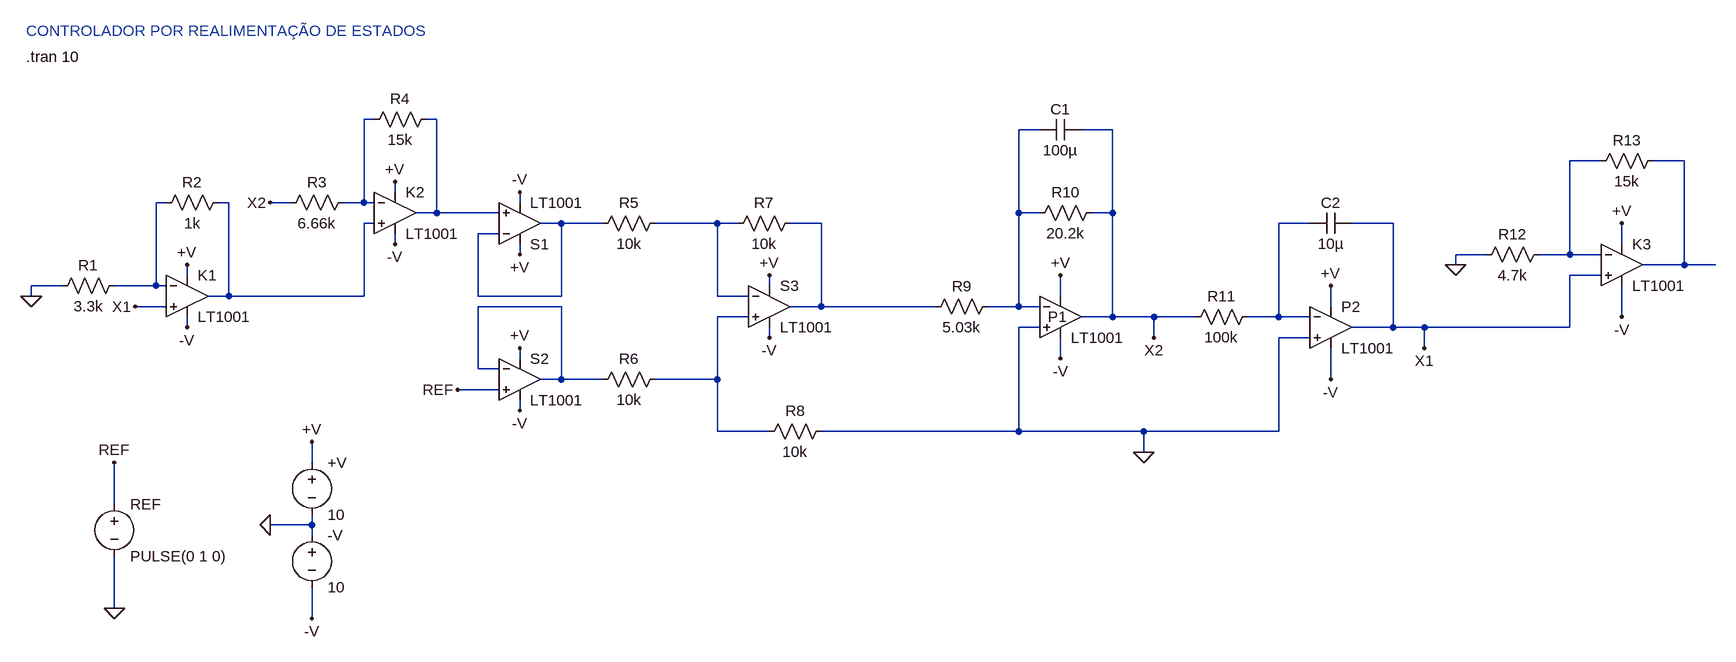
[diagram p0: schematic Plant_K.asc]
Plant_K.asc, the LTspice schematic file:
Version 4
SHEET 1 2304 1188
WIRE 192 -112 176 -112
WIRE 288 -112 272 -112
WIRE 1216 -96 1184 -96
WIRE 1328 -96 1280 -96
WIRE 2080 -48 2032 -48
WIRE 2208 -48 2160 -48
WIRE 224 0 224 -16
WIRE -128 16 -144 16
WIRE -32 16 -48 16
WIRE 64 16 32 16
WIRE 176 16 176 -112
WIRE 176 16 144 16
WIRE 192 16 176 16
WIRE 416 16 416 0
WIRE 288 32 288 -112
WIRE 288 32 256 32
WIRE 384 32 288 32
WIRE 1184 32 1184 -96
WIRE 1216 32 1184 32
WIRE 1328 32 1328 -96
WIRE 1328 32 1296 32
WIRE 192 48 176 48
WIRE 480 48 448 48
WIRE 544 48 480 48
WIRE 720 48 624 48
WIRE 752 48 720 48
WIRE 880 48 832 48
WIRE 1632 48 1584 48
WIRE 1760 48 1696 48
WIRE 384 64 352 64
WIRE 224 80 224 64
WIRE 2112 80 2112 48
WIRE 416 96 416 80
WIRE 1904 96 1856 96
WIRE 2032 96 2032 -48
WIRE 2032 96 1984 96
WIRE 2080 96 2032 96
WIRE 1856 112 1856 96
WIRE 2208 112 2208 -48
WIRE 2208 112 2144 112
WIRE 2256 112 2208 112
WIRE -96 128 -96 112
WIRE 2080 128 2032 128
WIRE -288 144 -336 144
WIRE -144 144 -144 16
WIRE -144 144 -208 144
WIRE -128 144 -144 144
WIRE 800 144 800 128
WIRE -336 160 -336 144
WIRE -32 160 -32 16
WIRE -32 160 -64 160
WIRE 176 160 176 48
WIRE 176 160 -32 160
WIRE 352 160 352 64
WIRE 480 160 480 48
WIRE 480 160 352 160
WIRE 720 160 720 48
WIRE 768 160 720 160
WIRE 1248 160 1248 128
WIRE -128 176 -176 176
WIRE 480 176 352 176
WIRE 880 176 880 48
WIRE 880 176 832 176
WIRE 1056 176 880 176
WIRE 1184 176 1184 32
WIRE 1184 176 1136 176
WIRE 1216 176 1184 176
WIRE 1664 176 1664 144
WIRE 768 192 720 192
WIRE 1328 192 1328 32
WIRE 1328 192 1280 192
WIRE 1392 192 1328 192
WIRE 1456 192 1392 192
WIRE 1584 192 1584 48
WIRE 1584 192 1536 192
WIRE 1632 192 1584 192
WIRE 2112 192 2112 144
WIRE -96 208 -96 192
WIRE 1216 208 1184 208
WIRE 1760 208 1760 48
WIRE 1760 208 1696 208
WIRE 1808 208 1760 208
WIRE 2032 208 2032 128
WIRE 2032 208 1808 208
WIRE 800 224 800 208
WIRE 1392 224 1392 192
WIRE 1632 224 1584 224
WIRE 1808 240 1808 208
WIRE 416 256 416 240
WIRE 1248 256 1248 224
WIRE 352 272 352 176
WIRE 384 272 352 272
WIRE 480 288 480 176
WIRE 480 288 448 288
WIRE 544 288 480 288
WIRE 720 288 720 192
WIRE 720 288 624 288
WIRE 1664 288 1664 240
WIRE 384 304 320 304
WIRE 416 336 416 320
WIRE 720 368 720 288
WIRE 800 368 720 368
WIRE 1184 368 1184 208
WIRE 1184 368 880 368
WIRE 1376 368 1184 368
WIRE 1584 368 1584 224
WIRE 1584 368 1376 368
WIRE 1376 400 1376 368
WIRE 96 416 96 384
WIRE -208 480 -208 416
WIRE 96 512 96 496
WIRE 96 512 32 512
WIRE 96 528 96 512
WIRE -208 640 -208 560
WIRE 96 656 96 608
FLAG 320 304 REF
FLAG 416 0 -V
FLAG 800 128 +V
FLAG 416 240 +V
FLAG 416 96 +V
FLAG 800 224 -V
FLAG 416 336 -V
FLAG 96 384 +V
FLAG 96 656 -V
FLAG 32 512 0
FLAG -208 640 0
FLAG -208 416 REF
FLAG 1664 144 +V
FLAG 1248 128 +V
FLAG 1664 288 -V
FLAG 1248 256 -V
FLAG 1376 400 0
FLAG -96 112 +V
FLAG -96 208 -V
FLAG 1392 224 X2
FLAG 224 -16 +V
FLAG 224 80 -V
FLAG 32 16 X2
FLAG -336 160 0
FLAG -176 176 X1
FLAG 1808 240 X1
FLAG 2112 48 +V
FLAG 2112 192 -V
FLAG 1856 112 0
SYMBOL Opamps\\LT1001 416 112 M180
SYMATTR InstName S1
SYMBOL Opamps\\LT1001 800 112 R0
SYMATTR InstName S3
SYMBOL Opamps\\LT1001 416 224 R0
SYMATTR InstName S2
SYMBOL res 640 32 R90
WINDOW 0 0 56 VBottom 2
WINDOW 3 32 56 VTop 2
SYMATTR InstName R5
SYMATTR Value 10k
SYMBOL res 640 272 R90
WINDOW 0 0 56 VBottom 2
WINDOW 3 32 56 VTop 2
SYMATTR InstName R6
SYMATTR Value 10k
SYMBOL res 848 32 R90
WINDOW 0 0 56 VBottom 2
WINDOW 3 32 56 VTop 2
SYMATTR InstName R7
SYMATTR Value 10k
SYMBOL res 896 352 R90
WINDOW 0 0 56 VBottom 2
WINDOW 3 32 56 VTop 2
SYMATTR InstName R8
SYMATTR Value 10k
SYMBOL voltage 96 400 R0
WINDOW 123 0 0 Left 2
WINDOW 39 0 0 Left 2
SYMATTR InstName +V
SYMATTR Value 10
SYMBOL voltage 96 512 R0
WINDOW 123 0 0 Left 2
WINDOW 39 0 0 Left 2
SYMATTR InstName -V
SYMATTR Value 10
SYMBOL voltage -208 464 R0
WINDOW 123 0 0 Left 2
WINDOW 39 0 0 Left 2
SYMATTR InstName REF
SYMATTR Value PULSE(0 1 0)
SYMBOL Opamps\\LT1001 1664 144 R0
SYMATTR InstName P2
SYMBOL Opamps\\LT1001 1248 128 R0
WINDOW 0 -19 64 Left 2
SYMATTR InstName P1
SYMBOL res 1552 176 R90
WINDOW 0 0 56 VBottom 2
WINDOW 3 32 56 VTop 2
SYMATTR InstName R11
SYMATTR Value 100k
SYMBOL res 1152 160 R90
WINDOW 0 0 56 VBottom 2
WINDOW 3 32 56 VTop 2
SYMATTR InstName R9
SYMATTR Value 5.03k
SYMBOL res 1312 16 R90
WINDOW 0 0 56 VBottom 2
WINDOW 3 32 56 VTop 2
SYMATTR InstName R10
SYMATTR Value 20.2k
SYMBOL cap 1280 -112 R90
WINDOW 0 0 32 VBottom 2
WINDOW 3 32 32 VTop 2
SYMATTR InstName C1
SYMATTR Value 100µ
SYMBOL Opamps\\LT1001 -96 96 R0
SYMATTR InstName K1
SYMBOL res -32 0 R90
WINDOW 0 0 56 VBottom 2
WINDOW 3 32 56 VTop 2
SYMATTR InstName R2
SYMATTR Value 1k
SYMBOL res -192 128 R90
WINDOW 0 0 56 VBottom 2
WINDOW 3 32 56 VTop 2
SYMATTR InstName R1
SYMATTR Value 3.3k
SYMBOL Opamps\\LT1001 224 -32 R0
SYMATTR InstName K2
SYMBOL res 288 -128 R90
WINDOW 0 0 56 VBottom 2
WINDOW 3 32 56 VTop 2
SYMATTR InstName R4
SYMATTR Value 15k
SYMBOL res 160 0 R90
WINDOW 0 0 56 VBottom 2
WINDOW 3 32 56 VTop 2
SYMATTR InstName R3
SYMATTR Value 6.66k
SYMBOL cap 1696 32 R90
WINDOW 0 0 32 VBottom 2
WINDOW 3 32 32 VTop 2
SYMATTR InstName C2
SYMATTR Value 10µ
SYMBOL Opamps\\LT1001 2112 48 R0
SYMATTR InstName K3
SYMBOL res 2000 80 R90
WINDOW 0 0 56 VBottom 2
WINDOW 3 32 56 VTop 2
SYMATTR InstName R12
SYMATTR Value 4.7k
SYMBOL res 2176 -64 R90
WINDOW 0 0 56 VBottom 2
WINDOW 3 32 56 VTop 2
SYMATTR InstName R13
SYMATTR Value 15k
TEXT -344 -248 Left 2 ;CONTROLADOR POR REALIMENTAÇÃO DE ESTADOS
TEXT -344 -208 Left 2 !.tran 10

The netlist it stands for:
* Plant_K.asc
XS1 N002 N008 +V -V N008 LT1001  ; pins In+ In- V+ V- OUT
XS3 N013 N009 +V -V N010 LT1001  ; pins In+ In- V+ V- OUT
XS2 REF N012 +V -V N012 LT1001  ; pins In+ In- V+ V- OUT
R5 N009 N008 10k
R6 N013 N012 10k
R7 N010 N009 10k
R8 0 N013 10k
V§+V +V 0 10
V§-V 0 -V 10
V§REF REF 0 PULSE(0 1 0)
XP2 0 N011 +V -V X1 LT1001  ; pins In+ In- V+ V- OUT
XP1 0 N003 +V -V X2 LT1001  ; pins In+ In- V+ V- OUT
R11 N011 X2 100k
R9 N003 N010 5.03k
R10 X2 N003 20.2k
C1 X2 N003 100µ
XK1 X1 N006 +V -V N007 LT1001  ; pins In+ In- V+ V- OUT
R2 N007 N006 1k
R1 N006 0 3.3k
XK2 N007 N001 +V -V N002 LT1001  ; pins In+ In- V+ V- OUT
R4 N002 N001 15k
R3 N001 X2 6.66k
C2 X1 N011 10µ
XK3 X1 N004 +V -V N005 LT1001  ; pins In+ In- V+ V- OUT
R12 N004 0 4.7k
R13 N005 N004 15k
* CONTROLADOR POR REALIMENTAÇÃO DE ESTADOS
.tran 10
.lib LTC.lib
.backanno
.end

* Results of the author's LTspice run, read from the files saved beside the schematic
* Operating Point, zero values left out:
*   V(+v) = 10 V
*   V(-v) = -10 V
*   I(-v) = -18 mA
*   I(+v) = -18 mA
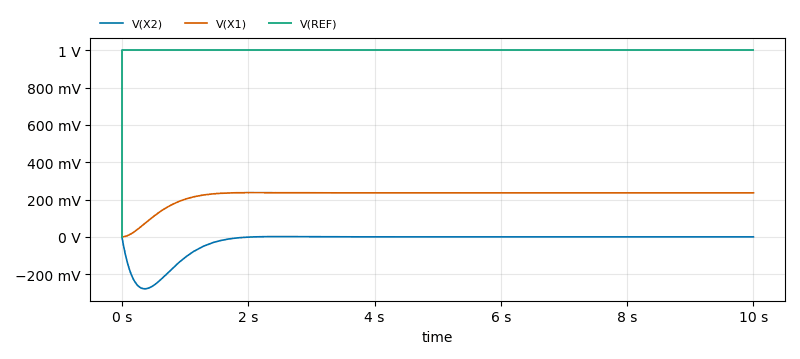
[diagram p1: Transient Analysis of Plant_K.asc, plotted from the saved traces]
* Transient Analysis, 1 run:
*   V(X2): min -278.4 mV, max 1.513 mV, average -23.63 mV, rms 68.79 mV, last -316.6 nV
*   V(X1): min -35.5 nV, max 237.3 mV, average 222 mV, rms 226.5 mV, last 236 mV
*   V(REF): min 0 V, max 1 V, average 1 V, rms 1 V, last 1 V